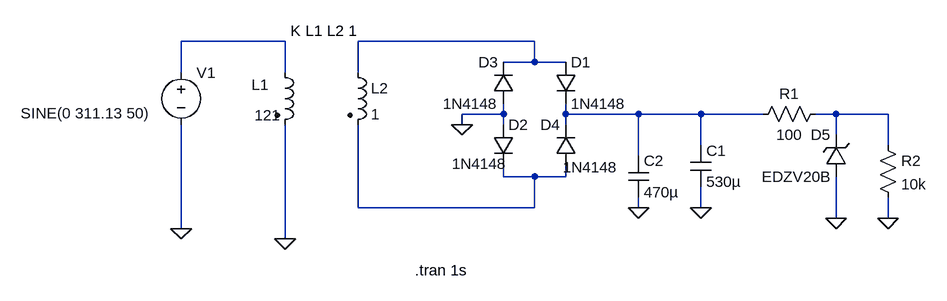
[diagram p0: schematic Stimulation.asc]
Stimulation.asc, the LTspice schematic file:
Version 4
SHEET 1 880 680
WIRE -400 64 -560 64
WIRE -16 64 -288 64
WIRE -16 96 -16 64
WIRE -16 96 -64 96
WIRE 32 96 -16 96
WIRE -560 112 -560 64
WIRE -400 112 -400 64
WIRE -288 112 -288 64
WIRE -64 176 -64 160
WIRE -64 176 -128 176
WIRE 32 176 32 160
WIRE 144 176 32 176
WIRE 240 176 144 176
WIRE 336 176 240 176
WIRE 448 176 416 176
WIRE 528 176 448 176
WIRE -128 192 -128 176
WIRE -64 192 -64 176
WIRE 32 192 32 176
WIRE 448 208 448 176
WIRE 240 224 240 176
WIRE 528 224 528 176
WIRE 144 240 144 176
WIRE -64 272 -64 256
WIRE -16 272 -64 272
WIRE 32 272 32 256
WIRE 32 272 -16 272
WIRE -288 320 -288 192
WIRE -16 320 -16 272
WIRE -16 320 -288 320
WIRE 144 320 144 304
WIRE 240 320 240 288
WIRE 448 336 448 272
WIRE 528 336 528 304
WIRE -560 352 -560 192
WIRE -400 368 -400 192
FLAG -128 192 0
FLAG -560 352 0
FLAG -400 368 0
FLAG 240 320 0
FLAG 448 336 0
FLAG 528 336 0
FLAG 144 320 0
SYMBOL voltage -560 96 R0
WINDOW 3 -247 79 Left 2
WINDOW 123 0 0 Left 0
WINDOW 39 0 0 Left 0
SYMATTR Value SINE(0 311.13 50)
SYMATTR InstName V1
SYMBOL diode 16 96 R0
SYMATTR InstName D1
SYMATTR Value 1N4148
SYMBOL diode -80 192 R0
WINDOW 3 -63 60 Left 2
SYMATTR Value 1N4148
SYMATTR InstName D2
SYMBOL diode -48 160 R180
WINDOW 0 24 64 Left 2
WINDOW 3 24 0 Left 2
SYMATTR InstName D3
SYMATTR Value 1N4148
SYMBOL diode 48 256 R180
WINDOW 0 24 64 Left 2
WINDOW 3 -64 -2 Left 2
SYMATTR InstName D4
SYMATTR Value 1N4148
SYMBOL ind2 -416 96 R0
WINDOW 0 -36 35 Left 2
WINDOW 3 -31 82 Left 2
SYMATTR InstName L1
SYMATTR Value 121
SYMATTR Type ind
SYMATTR SpiceLine Rser=0.001
SYMBOL ind2 -304 96 R0
SYMATTR InstName L2
SYMATTR Value 1
SYMATTR Type ind
SYMBOL cap 224 224 R0
SYMATTR InstName C1
SYMATTR Value 530µ
SYMBOL res 432 160 R90
WINDOW 0 0 56 VBottom 2
WINDOW 3 32 56 VTop 2
SYMATTR InstName R1
SYMATTR Value 100
SYMBOL zener 464 272 R180
WINDOW 0 24 64 Left 2
WINDOW 3 24 0 Left 2
SYMATTR InstName D5
SYMATTR Value EDZV20B
SYMBOL res 512 208 R0
SYMATTR InstName R2
SYMATTR Value 10k
SYMBOL cap 128 240 R0
SYMATTR InstName C2
SYMATTR Value 470µ
TEXT -392 48 Left 2 !K L1 L2 1
TEXT -200 416 Left 2 !.tran 1s

The netlist it stands for:
* Stimulation.asc
V1 N001 0 SINE(0 311.13 50)
D1 N002 N003 1N4148
D2 0 N005 1N4148
D3 0 N002 1N4148
D4 N005 N003 1N4148
L1 N001 0 121 Rser=0.001
L2 N002 N005 1
C1 N003 0 530µ
R1 N004 N003 100
D5 0 N004 EDZV20B
R2 N004 0 10k
C2 N003 0 470µ
.model D D
.lib standard.dio
K L1 L2 1
.tran 1s
.backanno
.end